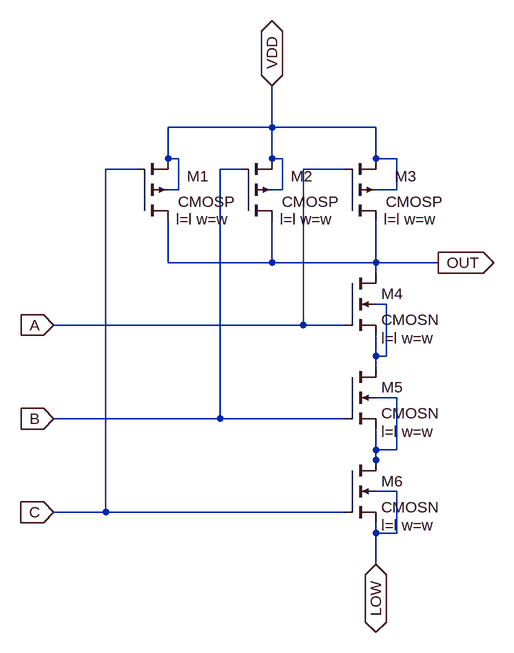
[diagram p0: schematic NAND3.asc]
NAND3.asc, the LTspice schematic file:
Version 4
SHEET 1 1216 840
WIRE 352 -48 352 -112
WIRE 352 -48 192 -48
WIRE 512 -48 352 -48
WIRE 192 0 192 -48
WIRE 208 0 192 0
WIRE 352 0 352 -48
WIRE 368 0 352 0
WIRE 512 0 512 -48
WIRE 544 0 512 0
WIRE 144 16 96 16
WIRE 304 16 272 16
WIRE 464 16 400 16
WIRE 208 48 208 0
WIRE 208 48 192 48
WIRE 368 48 368 0
WIRE 368 48 352 48
WIRE 544 48 544 0
WIRE 544 48 512 48
WIRE 192 160 192 96
WIRE 352 160 352 96
WIRE 352 160 192 160
WIRE 512 160 512 96
WIRE 512 160 352 160
WIRE 608 160 512 160
WIRE 512 176 512 160
WIRE 528 224 512 224
WIRE 400 256 400 16
WIRE 400 256 16 256
WIRE 464 256 400 256
WIRE 512 304 512 272
WIRE 528 304 528 224
WIRE 528 304 512 304
WIRE 512 320 512 304
WIRE 544 368 512 368
WIRE 272 400 272 16
WIRE 272 400 16 400
WIRE 464 400 272 400
WIRE 512 448 512 416
WIRE 544 448 544 368
WIRE 544 448 512 448
WIRE 512 464 512 448
WIRE 512 480 512 464
WIRE 544 512 512 512
WIRE 96 544 96 16
WIRE 96 544 16 544
WIRE 464 544 96 544
WIRE 512 576 512 560
WIRE 544 576 544 512
WIRE 544 576 512 576
WIRE 512 624 512 576
FLAG 352 -112 VDD
IOPIN 352 -112 BiDir
FLAG 16 256 A
IOPIN 16 256 In
FLAG 16 400 B
IOPIN 16 400 In
FLAG 16 544 C
IOPIN 16 544 In
FLAG 608 160 OUT
IOPIN 608 160 Out
FLAG 512 624 LOW
IOPIN 512 624 BiDir
SYMBOL nmos4 464 176 R0
WINDOW 123 56 100 Left 2
SYMATTR Value2 l=l w=w
SYMATTR InstName M4
SYMATTR Value CMOSN
SYMBOL nmos4 464 320 R0
WINDOW 123 56 100 Left 2
SYMATTR Value2 l=l w=w
SYMATTR InstName M5
SYMATTR Value CMOSN
SYMBOL nmos4 464 464 R0
WINDOW 123 56 100 Left 2
SYMATTR Value2 l=l w=w
SYMATTR InstName M6
SYMATTR Value CMOSN
SYMBOL pmos4 144 96 M180
WINDOW 123 60 3 Left 2
WINDOW 0 77 69 Left 2
WINDOW 3 63 30 Left 2
SYMATTR Value2 l=l w=w
SYMATTR InstName M1
SYMATTR Value CMOSP
SYMBOL pmos4 464 96 M180
WINDOW 123 60 3 Left 2
WINDOW 0 77 69 Left 2
WINDOW 3 63 30 Left 2
SYMATTR Value2 l=l w=w
SYMATTR InstName M3
SYMATTR Value CMOSP
SYMBOL pmos4 304 96 M180
WINDOW 123 60 3 Left 2
WINDOW 0 77 69 Left 2
WINDOW 3 63 30 Left 2
SYMATTR Value2 l=l w=w
SYMATTR InstName M2
SYMATTR Value CMOSP

The netlist it stands for:
* NAND3.asc
M4 OUT A N001 N001 CMOSN l=l w=w
M5 N001 B N002 N002 CMOSN l=l w=w
M6 N002 C LOW LOW CMOSN l=l w=w
M1 OUT C VDD VDD CMOSP l=l w=w
M3 OUT A VDD VDD CMOSP l=l w=w
M2 OUT B VDD VDD CMOSP l=l w=w
.model NMOS NMOS
.model PMOS PMOS
.lib standard.mos
.backanno
.end